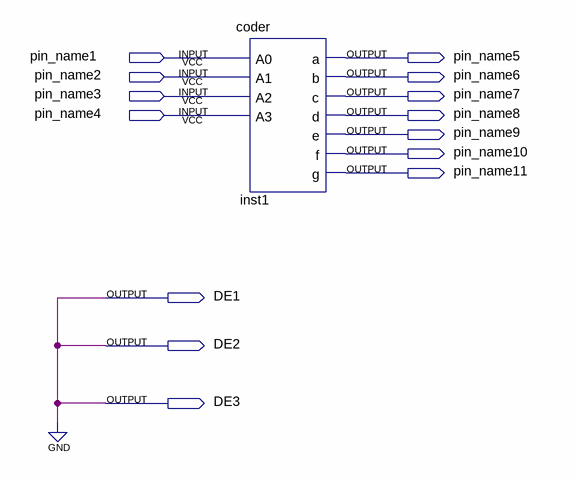
[diagram p0: schematic sheet]
// Quartus schematic seven_stage_shower.bdf as structural Verilog: 1 symbols, 14 pins
module seven_stage_shower (
  input  pin_name1,
  input  pin_name2,
  input  pin_name3,
  input  pin_name4,
  output pin_name5,
  output pin_name6,
  output pin_name7,
  output pin_name8,
  output pin_name9,
  output pin_name10,
  output pin_name11,
  output DE1,
  output DE2,
  output DE3
);

  coder inst1 (
    .A0(pin_name1), .A1(pin_name2), .A2(pin_name3), .A3(pin_name4), .a(pin_name5), .b(pin_name6),
    .c(pin_name7), .d(pin_name8), .e(pin_name9), .f(pin_name10), .g(pin_name11));

  assign DE1 = 1'b0;
  assign DE2 = 1'b0;
  assign DE3 = 1'b0;
endmodule
